# EAGLE design GPIB (EAGLE 6.3)
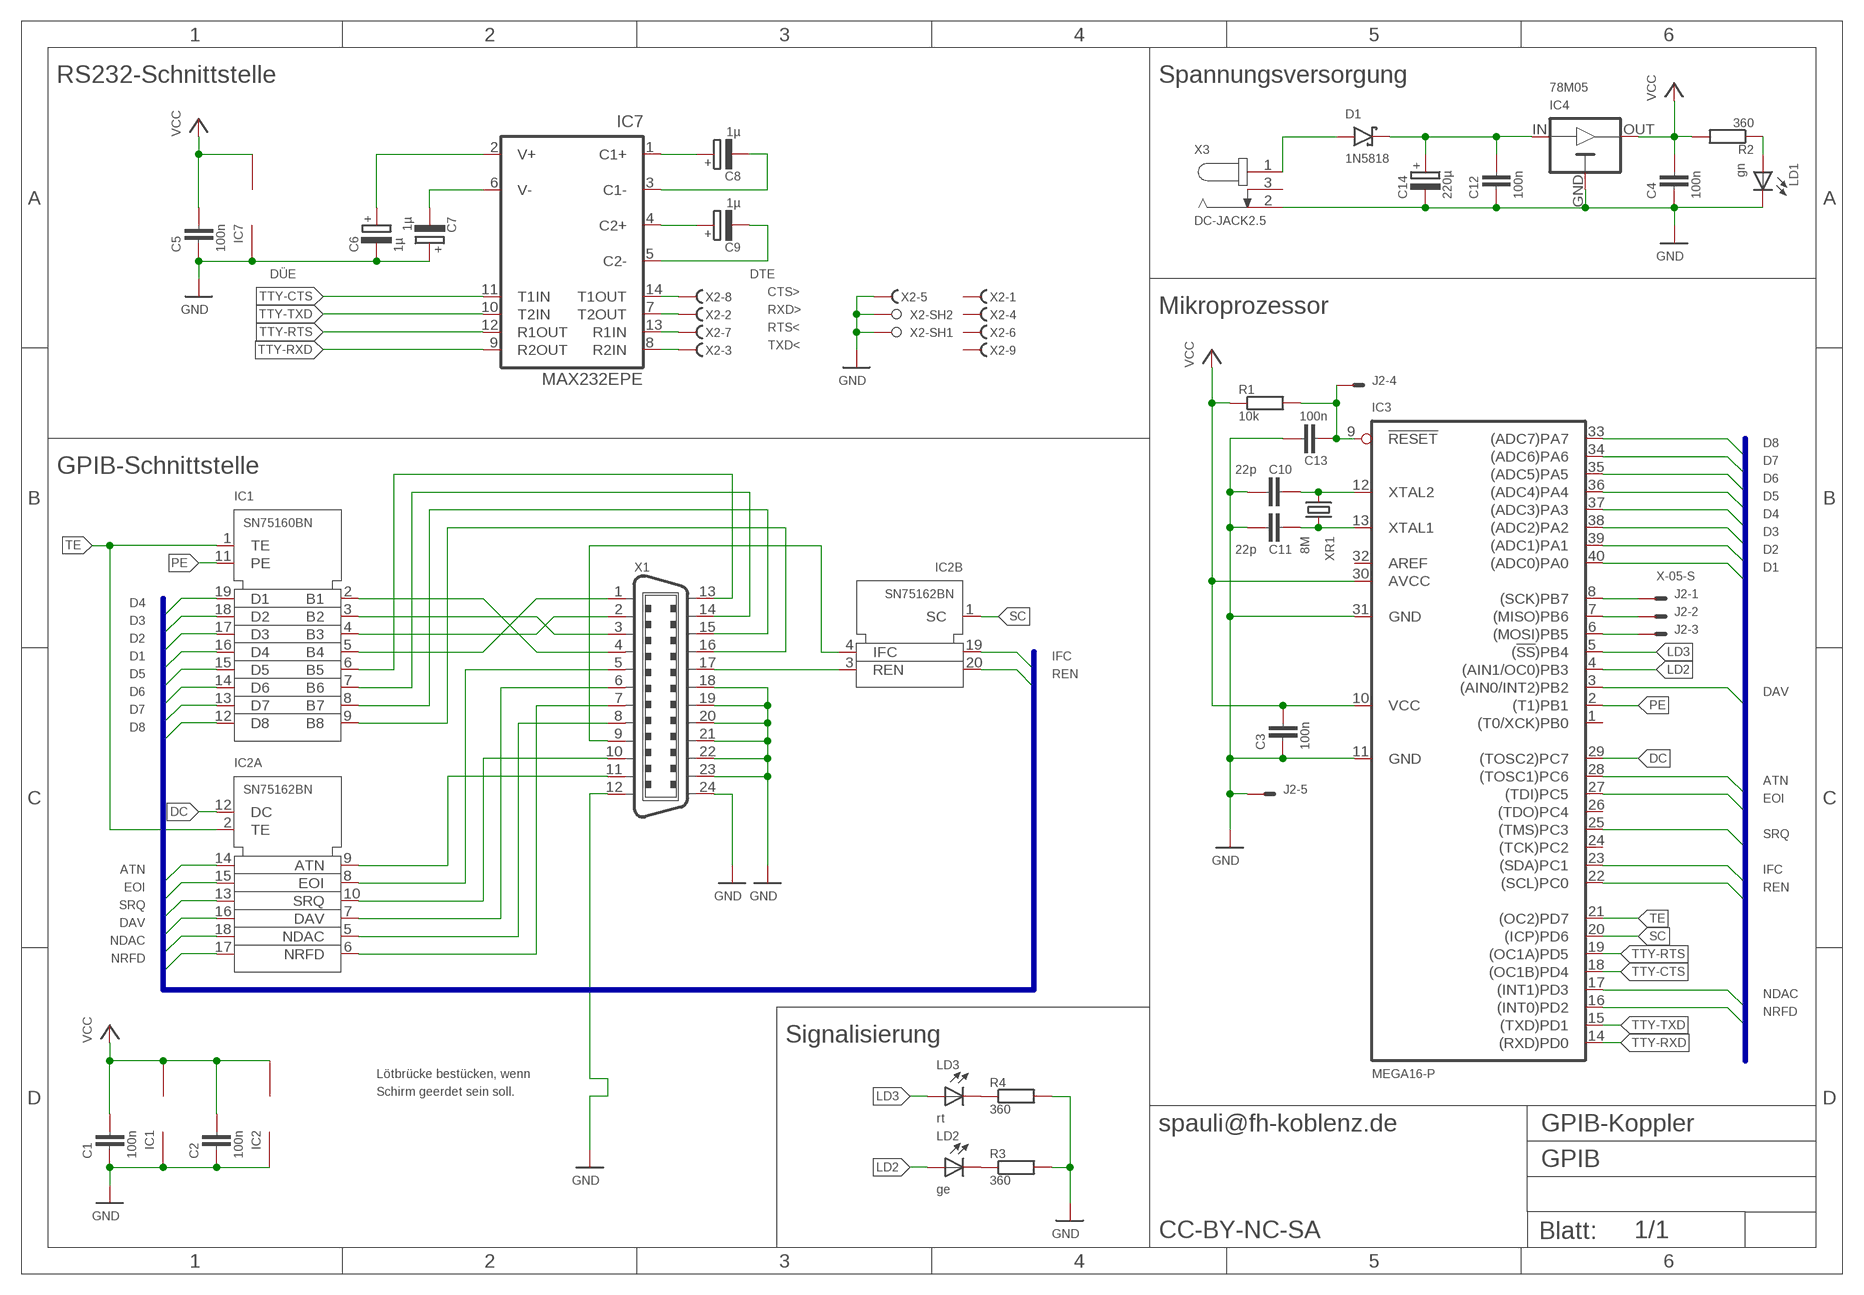
[diagram p0: schematic, sheet 1]

## Parts
C1  100n  C-024X044/020  [024X044/020]
C2  100n  C-024X044/020  [024X044/020]
C3  100n  C-024X044/020  [024X044/020]
C4  100n  C-024X044/020  [024X044/020]
C5  100n  C-024X044/020  [024X044/020]
C6  1µ  CPOL-D040/008  [POL-D040/008]
C7  1µ  CPOL-D040/008  [POL-D040/008]
C8  1µ  CPOL-D040/008  [POL-D040/008]
C9  1µ  CPOL-D040/008  [POL-D040/008]
C10  22p  C-024X044/010  [024X044/010]
C11  22p  C-024X044/010  [024X044/010]
C12  100n  C-024X044/020  [024X044/020]
C13  100n  C-024X044/020  [024X044/020]
C14  220µ  CPOL-D080/014  [POL-D080/014]
D1  1N5818  1N5818-DO41/40  [DO41/40]
IC1  SN75160BN  [DIL20]
IC2  SN75162BN  [DIL22-04]
IC3  MEGA16-P  [DIL40]
IC4  78M05  78M05-TO220-L  [78*-TO220-L]
IC7  MAX232EPE  [DIL16]
J2  X-05-S  [05/4X010-S]
LD1  gn  LED3MM-RUND  [LED3MM]
LD2  ge  LED3MM-RUND  [LED3MM]
LD3  rt  LED3MM-RUND  [LED3MM]
R1  10k  R-0204/030  [0204/030]
R2  360  R-0204/030  [0204/030]
R3  360  R-0204/030  [0204/030]
R4  360  R-0204/030  [0204/030]
X1  C24H  [24H]
X2  09F  [F09HP]
X3  DC-JACK2.5  [DC-2.5]
XR1  8M  XR-HC49-S  [HC49-S]

## Nets
!RESET: C13.2 IC3.9(!RESET) J2.4 R1.2
ATN: IC2.14(A:ATN_) IC3.28((TOSC1)PC6)
D1: IC1.16(D4) IC3.40((ADC0)PA0)
D2: IC1.17(D3) IC3.39((ADC1)PA1)
D3: IC1.18(D2) IC3.38((ADC2)PA2)
D4: IC1.19(D1) IC3.37((ADC3)PA3)
D5: IC1.15(D5) IC3.36((ADC4)PA4)
D6: IC1.14(D6) IC3.35((ADC5)PA5)
D7: IC1.13(D7) IC3.34((ADC6)PA6)
D8: IC1.12(D8) IC3.33((ADC7)PA7)
DAV: IC2.16(A:DAV_) IC3.3((AIN0/INT2)PB2)
DC: IC2.12(A:DC) IC3.29((TOSC2)PC7)
EOI: IC2.15(A:EOI_) IC3.27((TDI)PC5)
GND: C1.2 C2.2 C3.2 C4.2 C5.2 C6.- C7.+ C10.1 C11.1 C12.2 C13.1 C14.- IC1.10(GND) IC2.11(P:GND) IC3.11(GND) IC3.31(GND) IC4.GND IC7.15(GND) J2.5 LD1.K(C) R3.2 R4.2 X1.12 X1.18 X1.19 X1.20 X1.21 X1.22 X1.23 X1.24 X2.5 X2.SH1 X2.SH2 X3.2(GROUND)
IFC: IC2.19(B:IFC_) IC3.23((SDA)PC1)
LD2: IC3.4((AIN1/OC0)PB3) LD2.A
LD3: IC3.5((!SS!)PB4) LD3.A
MISO: IC3.7((MISO)PB6) J2.2
MOSI: IC3.6((MOSI)PB5) J2.3
N$1: C8.+ IC7.1(C1+)
N$2: C9.+ IC7.4(C2+)
N$3: C9.- IC7.5(C2-)
N$4: C8.- IC7.3(C1-)
N$5: C6.+ IC7.2(V+)
N$6: IC1.2(B1) X1.4
N$7: C7.- IC7.6(V-)
N$8: IC1.3(B2) X1.3
N$9: IC1.4(B3) X1.2
N$10: IC1.5(B4) X1.1
N$11: IC1.6(B5) X1.13
N$12: IC1.7(B6) X1.14
N$13: IC1.8(B7) X1.15
N$14: IC1.9(B8) X1.16
N$15: IC2.8(A:EOI) X1.5
N$16: IC2.7(A:DAV) X1.6
N$17: IC2.6(A:NRFD) X1.7
N$18: IC2.5(A:NDAC) X1.8
N$19: IC2.10(A:SRQ) X1.10
N$20: IC2.9(A:ATN) X1.11
N$21: IC2.3(B:REN) X1.17
N$22: IC2.4(B:IFC) X1.9
N$23: C10.2 IC3.12(XTAL2) XR1.1
N$24: C11.2 IC3.13(XTAL1) XR1.2
N$25: D1.A X3.1(LIVE)
N$26: C12.1 C14.+ D1.C IC4.IN
N$31: LD1.A R2.1
N$32: LD3.K(C) R4.1
N$33: LD2.K(C) R3.1
N$45: IC7.8(R2IN) X2.3
N$48: IC7.13(R1IN) X2.7
N$50: IC7.14(T1OUT) X2.8
N$52: IC7.7(T2OUT) X2.2
NDAC: IC2.18(A:NDAC_) IC3.17((INT1)PD3)
NRFD: IC2.17(A:NRFD_) IC3.16((INT0)PD2)
PE: IC1.11(PE) IC3.2((T1)PB1)
REN: IC2.20(B:REN_) IC3.22((SCL)PC0)
SC: IC2.1(B:SC) IC3.20((ICP)PD6)
SCK: IC3.8((SCK)PB7) J2.1
SRQ: IC2.13(A:SRQ_) IC3.25((TMS)PC3)
TE: IC1.1(TE) IC2.2(A:TE) IC3.21((OC2)PD7)
TTY-CTS: IC3.18((OC1B)PD4) IC7.11(T1IN)
TTY-RTS: IC3.19((OC1A)PD5) IC7.12(R1OUT)
TTY-RXD: IC3.14((RXD)PD0) IC7.9(R2OUT)
TTY-TXD: IC3.15((TXD)PD1) IC7.10(T2IN)
VCC: C1.1 C2.1 C3.1 C4.1 C5.1 IC1.20(VCC) IC2.22(P:VCC) IC3.10(VCC) IC3.30(AVCC) IC4.OUT IC7.16(VCC) R1.1 R2.2
Unconnected: IC3.1((T0/XCK)PB0) IC3.24((TCK)PC2) IC3.26((TDO)PC4) IC3.32(AREF) X2.1 X2.4 X2.6 X2.9 X3.3(SW)

## Buses
D[1..8],ATN,EOI,SRQ,DAV,NDAC,NRFD,IFC,REN

## Notes on the sheet
- RS232-Schnittstelle | Spannungsversorgung
- DÜE | DTE
- CTS>
- RXD> | Mikroprozessor
- RTS<
- TXD<
- GPIB-Schnittstelle
- Signalisierung
- Lötbrücke bestücken, wenn
- Schirm geerdet sein soll.
- spauli@fh-koblenz.de
- CC-BY-NC-SA

## Library data of the parts
C1-C5 C10-C13 = C:C-?: Kondensator
C6-C9 C14 = C:CPOL-?: Polarer Kondensator
D1 = D:1N58*-?: Schottky-Diode
IC1 = IC-com:SN75160*?: GPIB-Transceiver für Datenleitungen
IC2 = IC-com:SN75162*?: GPIB-Transceiver für Steuerleitungen
IC3 = IC-avr:MEGA16-P: Mikroprozessor Atmel.
IC4 = IC-vreg:78*-?: Linearregler, positiv
IC7 = IC-com:MAX232*: RS232-Schnittstellentreiber
J2 = X-molex:X-05-?: Steckverbinder
LD1-LD3 = LD:LED: Leuchtdiode
R1-R4 = R:R-?: Widerstand
X1 = X-centronics:C24H: Centronics-Buchse, 24 Pol
X2 = X-subd:09: SUBD-Printverbinder
X3 = X-jack:DC-JACK: Hohlstecker Mit Schaltkontakt.
XR1 = XR:XR-?: Schwingquarz

## Net classes
0 default: width 0.356 mm

## Board
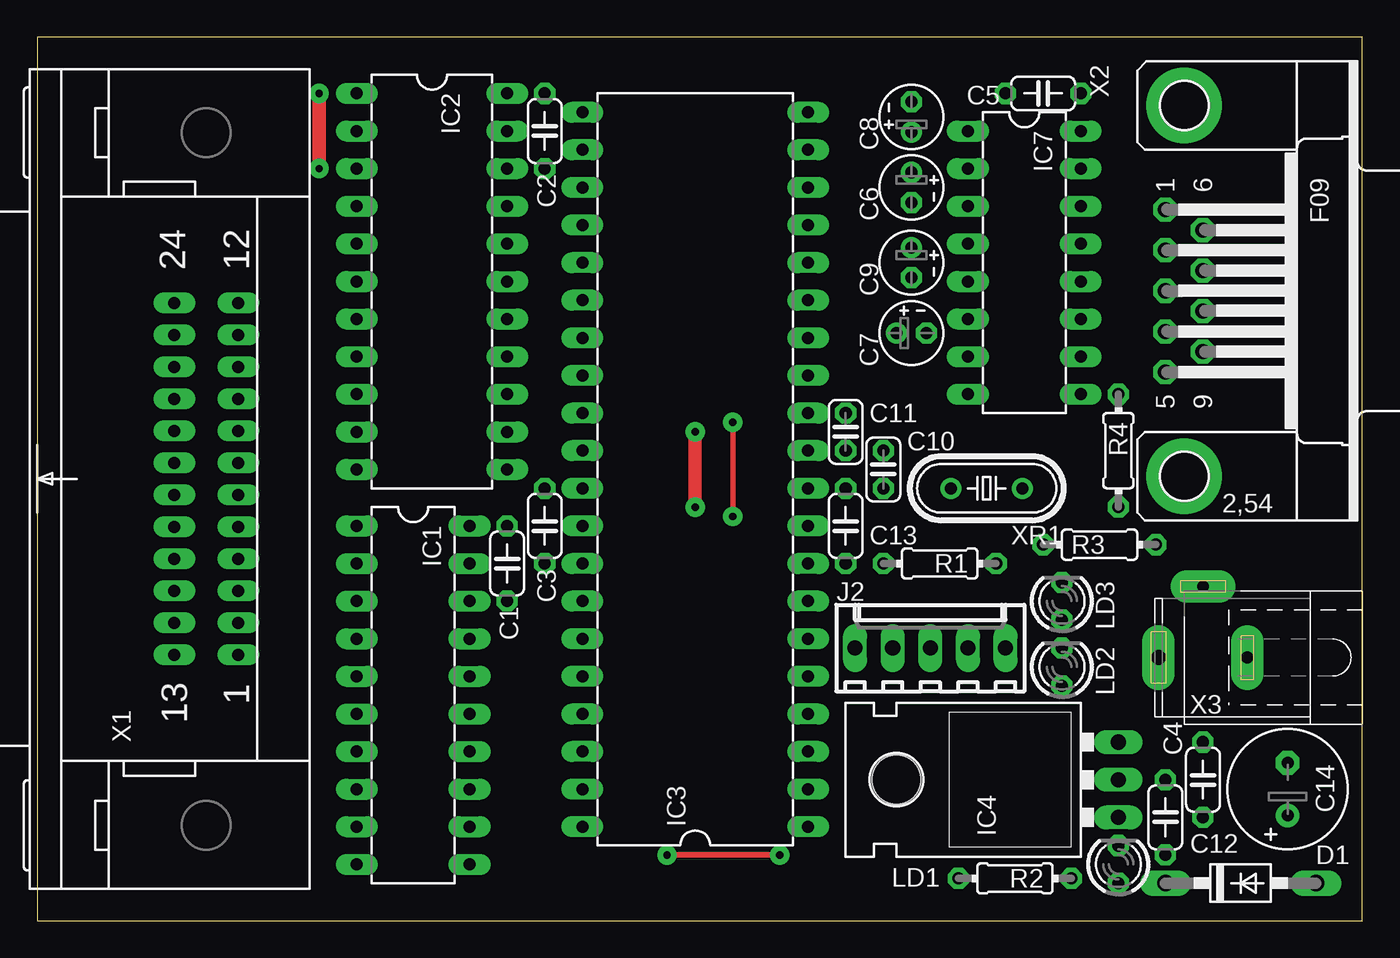
[diagram p1: board, top side]
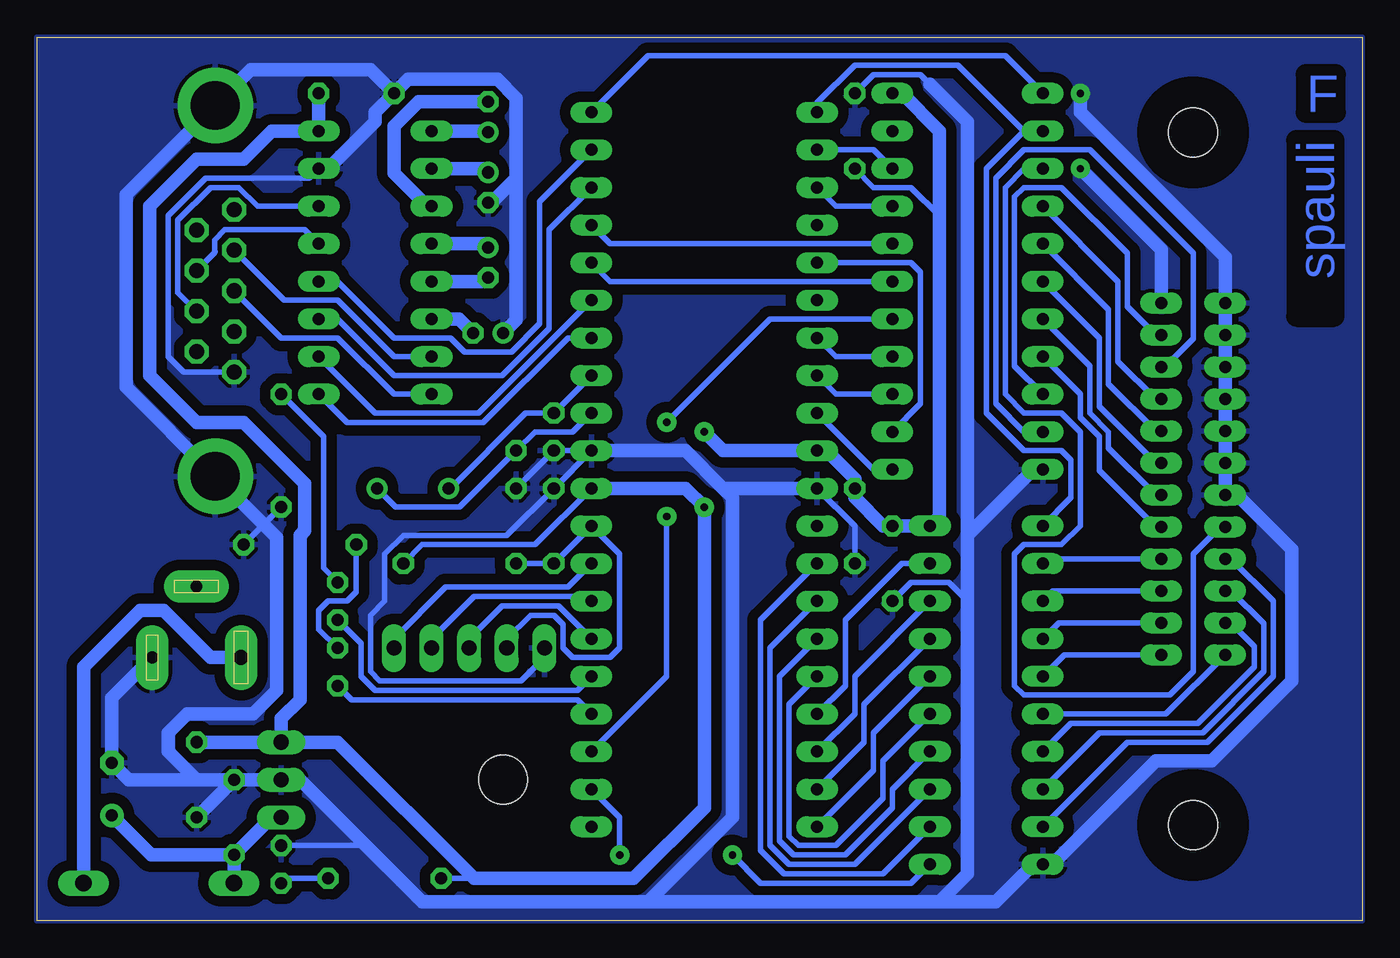
[diagram p2: board, bottom side, seen from below]

Size 89.51 x 59.69 mm. Coordinates in mm from the lower left corner, seen from the top.
Outline: 0,0 89.51,0 89.51,59.69 0,59.69 0,0
Copper layers (1*16): Top 0.035mm / dielectric 1.5mm / Bottom 0.035mm
Design rules "kamajii-100-100": minimum track width 10mil, minimum drill 0.5mm, track to track 10mil, track to pad 10mil, pad to pad 10mil, via to via 10mil, smd to smd 10mil, copper to edge 0mil, drill to drill 16mil, minimum pad ring 12mil, minimum via ring 16mil, stop-mask expansion 4mil, vias tented up to drill 0mil, thermal gap 10mil

### Footprints (pad centres in the part's own frame; a part is rotated, then mirrored left to right if it is on the bottom)
024X044/020 = drill 0.813 octagon: 1 -2.54,0; 2 2.54,0
POL-D040/008 = drill 0.813 pad 1.27: + -1.016,0 | drill 0.813 pad 1.27 octagon: - 1.016,0
024X044/010 = drill 0.813 octagon: 1 -1.27,0; 2 1.27,0
POL-D080/014 = drill 0.813 pad 1.6: + -1.778,0 | drill 0.813 pad 1.6 octagon: - 1.778,0
DO41/40 = drill 1.118 long: A 5.08,0; C -5.08,0
DIL20 = drill 0.813 long: 1 -12.7,-3.81; 2 -10.16,-3.81; 3 -7.62,-3.81; 4 -5.08,-3.81; 5 -2.54,-3.81; 6 0,-3.81; 7 2.54,-3.81; 8 5.08,-3.81; 9 7.62,-3.81; 10 10.16,-3.81; 11 10.16,3.81; 12 7.62,3.81; 13 5.08,3.81; 14 2.54,3.81; 15 0,3.81; 16 -2.54,3.81; 17 -5.08,3.81; 18 -7.62,3.81; 19 -10.16,3.81; 20 -12.7,3.81
DIL22-04 = drill 0.813 long: 1 -13.97,-5.08; 2 -11.43,-5.08; 3 -8.89,-5.08; 4 -6.35,-5.08; 5 -3.81,-5.08; 6 -1.27,-5.08; 7 1.27,-5.08; 8 3.81,-5.08; 9 6.35,-5.08; 10 8.89,-5.08; 11 11.43,-5.08; 12 11.43,5.08; 13 8.89,5.08; 14 6.35,5.08; 15 3.81,5.08; 16 1.27,5.08; 17 -1.27,5.08; 18 -3.81,5.08; 19 -6.35,5.08; 20 -8.89,5.08; 21 -11.43,5.08; 22 -13.97,5.08
DIL40 = drill 0.813 long: 1 -24.13,-7.62; 2 -21.59,-7.62; 3 -19.05,-7.62; 4 -16.51,-7.62; 5 -13.97,-7.62; 6 -11.43,-7.62; 7 -8.89,-7.62; 8 -6.35,-7.62; 9 -3.81,-7.62; 10 -1.27,-7.62; 11 1.27,-7.62; 12 3.81,-7.62; 13 6.35,-7.62; 14 8.89,-7.62; 15 11.43,-7.62; 16 13.97,-7.62; 17 16.51,-7.62; 18 19.05,-7.62; 19 21.59,-7.62; 20 24.13,-7.62; 21 24.13,7.62; 22 21.59,7.62; 23 19.05,7.62; 24 16.51,7.62; 25 13.97,7.62; 26 11.43,7.62; 27 8.89,7.62; 28 6.35,7.62; 29 3.81,7.62; 30 1.27,7.62; 31 -1.27,7.62; 32 -3.81,7.62; 33 -6.35,7.62; 34 -8.89,7.62; 35 -11.43,7.62; 36 -13.97,7.62; 37 -16.51,7.62; 38 -19.05,7.62; 39 -21.59,7.62; 40 -24.13,7.62
78*-TO220-L = drill 1.016 long: GND 0,-3.81; IN -2.54,-3.81; OUT 2.54,-3.81 | hole 3.302: 0,11.176
DIL16 = drill 0.813 long: 1 -10.16,-3.81; 2 -7.62,-3.81; 3 -5.08,-3.81; 4 -2.54,-3.81; 5 0,-3.81; 6 2.54,-3.81; 7 5.08,-3.81; 8 7.62,-3.81; 9 7.62,3.81; 10 5.08,3.81; 11 2.54,3.81; 12 0,3.81; 13 -2.54,3.81; 14 -5.08,3.81; 15 -7.62,3.81; 16 -10.16,3.81
05/4X010-S = drill 1.016 long: 1 5.08,0; 2 2.54,0; 3 0,0; 4 -2.54,0; 5 -5.08,0
LED3MM = drill 0.813 octagon: A -1.27,0; K 1.27,0
0204/030 = drill 0.813 octagon: 1 -3.81,0; 2 3.81,0
24H = drill 0.813 long: 1 -11.874,-2.159; 2 -9.716,-2.159; 3 -7.556,-2.159; 4 -5.397,-2.159; 5 -3.239,-2.159; 6 -1.079,-2.159; 7 1.079,-2.159; 8 3.239,-2.159; 9 5.397,-2.159; 10 7.556,-2.159; 11 9.716,-2.159; 12 11.874,-2.159; 13 -11.874,2.159; 14 -9.716,2.159; 15 -7.556,2.159; 16 -5.397,2.159; 17 -3.239,2.159; 18 -1.079,2.159; 19 1.079,2.159; 20 3.239,2.159; 21 5.397,2.159; 22 7.556,2.159; 23 9.716,2.159; 24 11.874,2.159 | hole 3.302: -23.393,0; 23.393,0
F09HP = drill 1.016 octagon: 1 -5.486,-1.27; 2 -2.743,-1.27; 3 0,-1.27; 4 2.743,-1.27; 5 5.486,-1.27; 6 -4.115,1.27; 7 -1.372,1.27; 8 1.372,1.27; 9 4.115,1.27 | drill 3.302 pad 5.08: SH1 -12.522,0; SH2 12.522,0
DC-2.5 = drill 1 pad 2.184 long: 1 3,0 | drill 0.8 pad 2.184 long: 2 -3,0; 3 0,-4.8
HC49-S = drill 0.813: 1 -2.413,0; 2 2.413,0

### Placement (x,y rotation side)
C1  31.75,24.13 270 top
C2  34.29,53.34 90 top
C3  34.29,26.67 270 top
C4  78.74,9.53 270 top
C5  67.94,55.88 180 top
C6  59.05,49.53 270 top
C7  59.05,39.69 0 top
C8  59.05,54.29 90 top
C9  59.05,44.45 270 top
C10  57.15,30.48 90 top
C11  54.61,33.02 90 top
C12  76.2,6.99 90 top
C13  54.61,26.67 270 top
C14  84.45,8.89 90 top
D1  81.28,2.54 0 top
IC1  25.4,13.97 270 top
IC2  26.67,41.91 270 top
IC3  44.45,30.48 90 top
IC4  69.22,9.53 90 top
IC7  66.67,43.18 270 top
J2  60.33,18.41 0 top
LD1  73.03,3.81 90 top
LD2  69.22,17.14 90 top
LD3  69.22,21.59 90 top
R1  60.96,24.13 180 top
R2  66.04,2.86 180 top
R3  71.75,25.4 0 top
R4  73.03,31.75 270 top
X1  11.43,29.84 90 top
X2  77.47,42.55 270 top
X3  78.74,17.78 180 top
XR1  64.14,29.21 180 top

### Tracks (layer width: path | path; a pad name or v marks a point on that pad's centre or on a via)
!RESET
  Bottom 0.356: R1.2 C13.2 IC3.9 50.16,24.77 50.16,18.41 50.8,17.78 53.34,17.78 53.98,18.41 53.98,20 54.61,20.64 56.2,20.64 57.78,19.05 J2.4
ATN
  Bottom 0.356: IC3.28 35.56,35.56 IC2.14
D1
  Bottom 0.356: IC1.16 33.02,12.7 33.02,10.16 IC3.40
D2
  Bottom 0.356: IC1.17 33.66,14.61 33.66,12.06 IC3.39
D3
  Bottom 0.356: IC1.18 34.29,16.51 34.29,13.97 IC3.38
D4
  Bottom 0.356: IC3.37 34.92,15.88 34.92,20.32 31.11,24.13 IC1.19
D5
  Bottom 0.356: IC1.15 32.38,10.79 32.38,8.26 35.56,5.08 38.1,5.08 38.73,5.71 38.73,14.61 IC3.36
D6
  Bottom 0.356: IC1.14 31.75,8.89 31.75,7.62 34.92,4.45 38.42,4.45 39.37,5.4 39.37,16.51 IC3.35
D7
  Bottom 0.356: IC1.13 34.29,3.81 38.73,3.81 40.01,5.08 40.01,18.41 IC3.34
D8
  Bottom 0.356: IC1.12 32.38,3.17 39.05,3.17 40.64,4.76 40.64,20.32 IC3.33
DAV  (via drill 0.5)
  Top 0.356: v46.99,27.3 v46.99,33.66
  Bottom 0.356: v46.99,27.3 46.99,16.51 IC3.3 | IC2.16 40.01,40.64 v46.99,33.66
DC
  Bottom 0.356: IC3.29 33.02,30.48 IC2.12
EOI
  Bottom 0.356: IC3.27 35.56,38.1 IC2.15
GND  (via drill 0.5)
  Top 0.914: v19.05,55.88 v19.05,50.8
  Bottom 0.356: C1.2 30.48,22.86 27.94,22.86 26.67,21.59 | C3.2 34.29,26.67 IC3.31 | C10.1 C11.1 IC3.11 C13.1 57.78,26.04 64.77,26.04 66.04,24.77 66.04,21.59 66.99,20.64 66.99,16.83 66.36,16.19 56.83,16.19 55.24,17.78 J2.5 | X2.5 79.6,37.06 80.64,38.1 80.64,47.62 78.11,50.16 71.12,50.16 IC7.15 | 67.31,5.08 LD1.K | C2.2 33.02,57.15 29.84,57.15 29.21,56.52 | R4.2 74.21,26.76 R3.2
  Bottom 0.914: 43.18,29.21 IC3.31 | 43.18,29.21 45.72,31.75 IC3.11 | 28.57,1.27 24.77,1.27 22.23,3.81 IC1.10 20.95,3.81 13.97,10.79 10.16,10.79 4.76,16.19 4.76,25.08 8.45,28.77 X1.18 X1.19 X1.20 X1.21 X1.22 X1.23 X1.24 9.27,44.83 19.05,54.61 v19.05,55.88 | 43.18,29.21 42.55,28.57 42.55,6.99 48.26,1.27 | 26.67,26.04 26.67,21.59 26.67,3.17 28.57,1.27 | IC2.11 22.23,30.48 26.67,26.04 | v19.05,50.8 13.59,45.34 X1.12 | IC7.15 69.85,50.8 66.67,53.98 66.67,54.61 C5.2 | C5.2 64.45,56.83 58.42,56.83 57.15,55.56 57.15,50.16 | 28.57,1.27 48.26,1.27 | C12.2 IC4.GND 71.75,9.53 67.31,5.08 63.5,1.27 48.26,1.27 | C7.+ 57.15,40.58 57.15,50.16 | C6.- 58.8,48.51 57.15,50.16 | C12.2 C4.2 | X3.2 84.45,15.06 C14.- 83.31,9.53 78.74,9.53 | C12.2 78.74,9.53 | 78.74,9.53 80.64,11.43 80.64,12.7 79.38,13.97 74.93,13.97 73.34,15.56 73.34,25.89 74.21,26.76 X2.SH2 83.5,36.05 83.5,49.03 X2.SH1 75.07,57.47 66.99,57.47 C5.2 | 26.67,26.04 26.67,53.98 29.21,56.52
  pour Bottom (isolate 0.711): 0,0 89.53,0 89.53,59.69 0,59.69
IFC
  Bottom 0.356: IC2.19 35.56,48.26 IC3.23
LD2
  Bottom 0.356: LD2.A 68.26,14.92 53.02,14.92 IC3.4
LD3
  Bottom 0.356: IC3.5 53.02,15.56 66.67,15.56 67.63,16.51 67.63,18.73 LD3.A
MISO
  Bottom 0.356: J2.2 62.87,19.05 60.01,21.91 52.39,21.91 IC3.7
MOSI
  Bottom 0.356: IC3.6 54.29,21.27 58.1,21.27 60.33,19.05 J2.3
N$1
  Bottom 0.914: C8.+ 59.12,53.34 IC7.1
N$2
  Bottom 0.914: IC7.4 59.31,45.72 C9.+
N$3
  Bottom 0.914: IC7.5 59.31,43.18 C9.-
N$4
  Bottom 0.914: IC7.3 63.18,48.26 65.41,50.48 65.41,53.66 63.75,55.31 C8.-
N$5
  Bottom 0.914: IC7.2 59.31,50.8 C6.+
N$6
  Bottom 0.356: IC1.2 21.27,24.45 X1.4
N$7
  Bottom 0.914: IC7.6 61.02,40.64 C7.-
N$8
  Bottom 0.356: IC1.3 20.89,22.29 X1.3
N$9
  Bottom 0.356: IC1.4 20.51,20.13 X1.2
N$10
  Bottom 0.356: IC1.5 20.13,17.97 X1.1
N$11
  Bottom 0.356: IC1.6 13.27,13.97 X1.13
N$12
  Bottom 0.356: IC1.7 19.68,13.34 11.11,13.34 7.3,17.14 7.3,18.54 8.89,20.13 X1.14
N$13
  Bottom 0.356: IC1.8 17.78,12.7 10.79,12.7 6.67,16.83 6.67,20.07 8.89,22.29 X1.15
N$14
  Bottom 0.356: IC1.9 15.88,12.06 10.48,12.06 6.03,16.51 6.03,21.59 8.89,24.45 X1.16
N$15
  Bottom 0.356: IC2.8 19.05,35.56 19.05,33.97 17.78,32.7 17.78,30.42 13.97,26.61 X1.5
N$16
  Bottom 0.356: IC2.7 18.41,37.47 18.41,34.29 17.14,33.02 17.14,31.94 13.97,28.77 X1.6
N$17
  Bottom 0.356: IC2.6 17.78,39.37 17.78,34.73 13.97,30.92 X1.7
N$18
  Bottom 0.356: IC2.5 17.14,41.27 17.14,36.26 13.97,33.08 X1.8
N$19
  Bottom 0.356: IC2.10 22.86,33.02 24.77,34.92 24.77,50.16 22.86,52.07 18.41,52.07 11.43,45.09 11.43,39.31 13.34,37.4 X1.10
N$20
  Bottom 0.356: IC2.9 23.5,37.47 23.5,48.9 22.86,49.53 20.32,49.53 15.88,45.09 15.88,41.47 13.97,39.56 X1.11
N$21
  Bottom 0.356: IC2.3 22.86,50.8 24.13,49.53 24.13,35.56 22.86,34.29 20.32,34.29 19.05,33.02 19.05,26.67 20.32,25.4 22.86,25.4 23.5,24.77 23.5,15.88 22.86,15.24 13.02,15.24 11.43,16.83 11.43,24.77 9.59,26.61 X1.17
N$22
  Bottom 0.356: IC2.4 16.51,43.18 16.51,37.78 13.97,35.24 X1.9
N$23
  Bottom 0.356: IC3.12 53.34,33.02 55.88,33.02 C10.2 60.96,27.94 65.28,27.94 XR1.1
N$24
  Bottom 0.356: IC3.13 C11.2 56.52,34.29 61.59,29.21 XR1.2
N$25
  Bottom 0.914: X3.1 77.79,17.78 80.96,20.95 82.55,20.95 86.36,17.14 D1.A
N$26
  Bottom 0.914: C12.1 73.66,6.99 IC4.IN | D1.C C12.1 | C14.+ 81.79,4.45 C12.1
N$31
  Bottom 0.356: LD1.A 72.71,2.86 R2.1
N$32
  Bottom 0.356: LD3.K 70.17,23.81 70.17,32.7 R4.1
N$33
  Bottom 0.356: R3.1 67.94,22.23 68.58,21.59 69.85,21.59 70.48,20.95 70.48,19.68 LD2.K
N$45
  Bottom 0.356: IC7.8 65.41,35.56 69.22,39.37 73.03,39.37 X2.3
N$48
  Bottom 0.356: IC7.13 71.44,46.67 76.83,46.67 77.52,45.99 77.52,45.14 | 77.47,45.19 77.52,45.14 | 77.52,45.14 X2.7
N$50
  Bottom 0.356: X2.8 80.01,42.44 80.01,47.31 77.79,49.53 75.88,49.53 74.61,48.26 IC7.14
N$52
  Bottom 0.356: IC7.7 65.41,38.1 69.22,41.91 72.82,41.91 X2.2
NDAC
  Bottom 0.356: IC3.17 50.8,45.72 IC2.18
NRFD
  Bottom 0.356: IC3.16 50.8,43.18 IC2.17
PE  (via drill 0.5)
  Top 0.356: v42.55,4.45 v50.16,4.45
  Bottom 0.356: IC1.11 30.48,2.54 40.64,2.54 v42.55,4.45 | IC3.2 50.16,6.99 v50.16,4.45
REN
  Bottom 0.356: IC3.22 33.02,52.07 IC2.20
SC
  Bottom 0.356: IC2.1 24.13,58.42 48.26,58.42 IC3.20
SCK
  Bottom 0.356: IC3.8 53.66,22.54 61.91,22.54 65.41,19.05 J2.1
SRQ
  Bottom 0.356: IC2.13 29.84,34.92 29.84,43.81 30.48,44.45 IC3.25
TE
  Bottom 0.356: IC1.1 19.68,28.57 19.68,31.11 20.32,31.75 22.86,31.75 25.4,34.29 25.4,50.8 22.86,53.34 | 22.86,53.34 IC2.2 | 22.86,53.34 27.3,57.78 34.29,57.78 36.83,55.24 IC3.21
TTY-CTS
  Bottom 0.356: IC7.11 69.22,40.64 65.41,36.83 58.1,36.83 54.93,40.01 54.93,46.67 IC3.18
TTY-RTS
  Bottom 0.356: IC7.12 69.22,43.18 65.41,39.37 61.59,39.37 60.64,38.42 57.47,38.42 55.56,40.32 55.56,48.58 IC3.19
TTY-RXD
  Bottom 0.356: IC7.9 68.58,33.66 59.37,33.66 53.66,39.37 IC3.14
TTY-TXD
  Bottom 0.356: IC3.15 59.69,34.29 66.67,34.29 IC7.10
VCC  (via drill 0.5)
  Top 0.914: v44.45,27.94 v44.45,33.02
  Bottom 0.356: C2.1 33.02,49.53 30.48,49.53 28.57,47.62 | IC3.10 55.88,25.4 63.5,25.4 R1.1 | 60.01,2.86 R2.2
  Bottom 0.914: C5.1 IC7.16 73.66,53.34 75.56,51.44 78.74,51.44 81.92,48.26 81.92,36.83 78.74,33.66 75.56,33.66 71.44,29.53 71.44,26.35 71.75,26.04 71.75,14.92 73.03,13.65 IC4.OUT | IC2.22 31.11,55.88 28.57,53.34 28.57,47.62 28.57,27.3 IC1.20 C1.1 32.38,26.67 34.29,28.57 C3.1 34.29,29.84 36.2,31.75 IC3.30 43.18,31.75 v44.45,33.02 | IC3.10 45.72,29.21 v44.45,27.94 44.45,7.62 49.21,2.86 60.01,2.86 69.22,12.06 IC4.OUT | IC4.OUT C4.1

### Text on the board
Bottom: F | spauli